# EAGLE design STKbd (EAGLE 8.0.1)
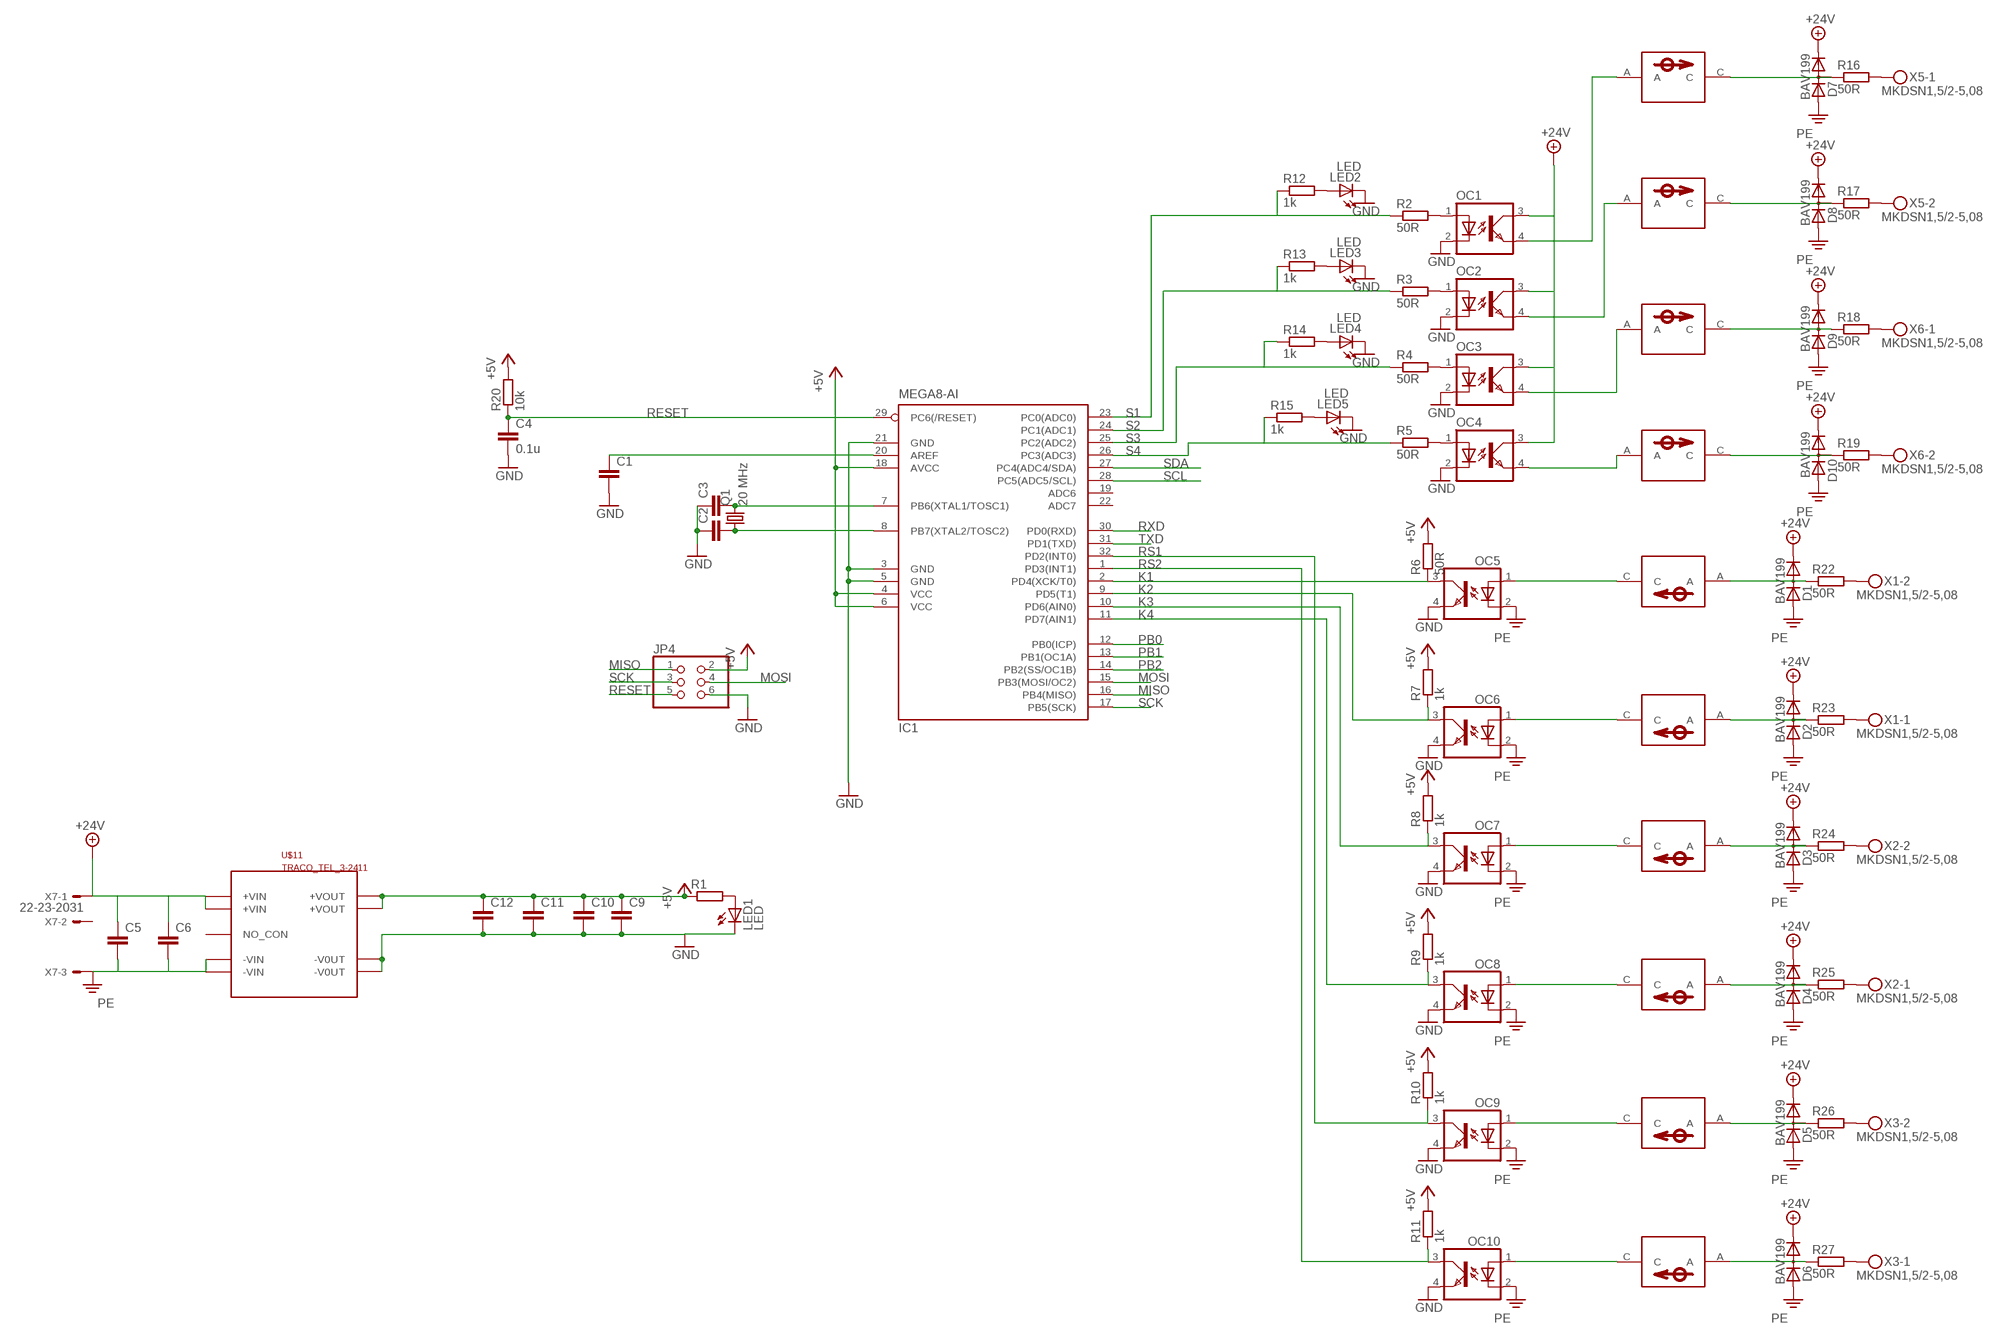
[diagram p0: schematic, sheet 1]

## Parts
C1  C-EUC0805K  [C0805K]
C2  C-EUC0805  [C0805]
C3  C-EUC0805  [C0805]
C4  0.1u  C-EUC0805K  [C0805K]
C5  C-EUC0805  [C0805]
C6  C-EUC0805  [C0805]
C9  C-EUC0805  [C0805]
C10  C-EUC0805  [C0805]
C11  C-EUC0805  [C0805]
C12  C-EUC0805  [C0805]
D1  BAV199  [SOT23]
D2  BAV199  [SOT23]
D3  BAV199  [SOT23]
D4  BAV199  [SOT23]
D5  BAV199  [SOT23]
D6  BAV199  [SOT23]
D7  BAV199  [SOT23]
D8  BAV199  [SOT23]
D9  BAV199  [SOT23]
D10  BAV199  [SOT23]
IC1  MEGA8-AI  [TQFP32-08]
JP4  PINHD-2X3  [2X03]
LED1  LED  [LED3MM]
LED2  LED  [LED3MM]
LED3  LED  [LED3MM]
LED4  LED  [LED3MM]
LED5  LED  [LED3MM]
OC1  SFH6106REAL  [SFH6106]
OC2  SFH6106REAL  [SFH6106]
OC3  SFH6106REAL  [SFH6106]
OC4  SFH6106REAL  [SFH6106]
OC5  SFH6106REAL  [SFH6106]
OC6  SFH6106REAL  [SFH6106]
OC7  SFH6106REAL  [SFH6106]
OC8  SFH6106REAL  [SFH6106]
OC9  SFH6106REAL  [SFH6106]
OC10  SFH6106REAL  [SFH6106]
Q1  20 MHz  CRYSTALSM49  [SM49]
R1  R-EU_R0805  [R0805]
R2  50R  R-EU_R0805  [R0805]
R3  50R  R-EU_R0805  [R0805]
R4  50R  R-EU_R0805  [R0805]
R5  50R  R-EU_R0805  [R0805]
R6  50R  R-EU_R0805  [R0805]
R7  1k  R-EU_R0805  [R0805]
R8  1k  R-EU_R0805  [R0805]
R9  1k  R-EU_R0805  [R0805]
R10  1k  R-EU_R0805  [R0805]
R11  1k  R-EU_R0805  [R0805]
R12  1k  R-EU_R0805  [R0805]
R13  1k  R-EU_R0805  [R0805]
R14  1k  R-EU_R0805  [R0805]
R15  1k  R-EU_R0805  [R0805]
R16  50R  R-EU_R0805  [R0805]
R17  50R  R-EU_R0805  [R0805]
R18  50R  R-EU_R0805  [R0805]
R19  50R  R-EU_R0805  [R0805]
R20  10k  R-EU_R0805  [R0805]
R22  50R  R-EU_R0805  [R0805]
R23  50R  R-EU_R0805  [R0805]
R24  50R  R-EU_R0805  [R0805]
R25  50R  R-EU_R0805  [R0805]
R26  50R  R-EU_R0805  [R0805]
R27  50R  R-EU_R0805  [R0805]
U$1  NSI45020AT1GSOD-123  [SOD123]
U$2  NSI45020AT1GSOD-123  [SOD123]
U$3  NSI45020AT1GSOD-123  [SOD123]
U$4  NSI45020AT1GSOD-123  [SOD123]
U$5  NSI45020AT1GSOD-123  [SOD123]
U$6  NSI45020AT1GSOD-123  [SOD123]
U$7  NSI45020AT1GSOD-123  [SOD123]
U$8  NSI45020AT1GSOD-123  [SOD123]
U$9  NSI45020AT1GSOD-123  [SOD123]
U$10  NSI45020AT1GSOD-123  [SOD123]
U$11  TRACO_TEL_3-2411  [TEL-3]
X1  MKDSN1,5/2-5,08  [MKDSN1,5/2-5,08]
X2  MKDSN1,5/2-5,08  [MKDSN1,5/2-5,08]
X3  MKDSN1,5/2-5,08  [MKDSN1,5/2-5,08]
X5  MKDSN1,5/2-5,08  [MKDSN1,5/2-5,08]
X6  MKDSN1,5/2-5,08  [MKDSN1,5/2-5,08]
X7  22-23-2031  [22-23-2031]

## Nets
+5V: C9.1 C10.1 C11.1 C12.1 IC1.4(VCC) IC1.6(VCC) IC1.18(AVCC) JP4.2 R1.1 R6.2 R7.2 R8.2 R9.2 R10.2 R11.2 R20.2 U$11.11(+VOUT) U$11.14(+VOUT)
+24V: C5.1 C6.1 D1.2(C) D2.2(C) D3.2(C) D4.2(C) D5.2(C) D6.2(C) D7.2(C) D8.2(C) D9.2(C) D10.2(C) OC1.3(COL) OC2.3(COL) OC3.3(COL) OC4.3(COL) U$11.1(+VIN) U$11.24(+VIN) X7.1
GND: C1.2 C2.1 C3.1 C4.2 C9.2 C10.2 C11.2 C12.2 IC1.3(GND) IC1.5(GND) IC1.21(GND) JP4.6 LED1.K(C) LED2.K(C) LED3.K(C) LED4.K(C) LED5.K(C) OC1.2(C) OC2.2(C) OC3.2(C) OC4.2(C) OC5.4(EMIT) OC6.4(EMIT) OC7.4(EMIT) OC8.4(EMIT) OC9.4(EMIT) OC10.4(EMIT) U$11.10(-V0UT) U$11.15(-V0UT)
K1: IC1.2(PD4(XCK/T0)) OC5.3(COL) R6.1
K2: IC1.9(PD5(T1)) OC6.3(COL) R7.1
K3: IC1.10(PD6(AIN0)) OC7.3(COL) R8.1
K4: IC1.11(PD7(AIN1)) OC8.3(COL) R9.1
MISO: IC1.16(PB4(MISO)) JP4.1
MOSI: IC1.15(PB3(MOSI/OC2)) JP4.4
N$1: OC1.1(A) R2.2
N$2: C1.1 IC1.20(AREF)
N$3: C3.2 IC1.7(PB6(XTAL1/TOSC1)) Q1.2
N$4: C2.2 IC1.8(PB7(XTAL2/TOSC2)) Q1.1
N$5: OC2.1(A) R3.2
N$6: OC3.1(A) R4.2
N$7: OC4.1(A) R5.2
N$8: R24.2 X2.2
N$9: D2.3(AC) R23.1 U$2.A
N$10: D7.3(AC) R16.1 U$7.C
N$11: D8.3(AC) R17.1 U$8.C
N$12: LED2.A R12.2
N$13: R16.2 X5.1
N$14: R17.2 X5.2
N$16: OC6.1(A) U$2.C
N$17: D9.3(AC) R18.1 U$9.C
N$18: R18.2 X6.1
N$19: D10.3(AC) R19.1 U$10.C
N$20: R19.2 X6.2
N$21: LED3.A R13.2
N$22: R22.2 X1.2
N$23: LED4.A R14.2
N$24: R26.2 X3.2
N$25: R23.2 X1.1
N$26: R25.2 X2.1
N$27: LED5.A R15.2
N$28: OC4.4(EMIT) U$10.A
N$29: OC3.4(EMIT) U$9.A
N$30: OC2.4(EMIT) U$8.A
N$31: OC8.1(A) U$4.C
N$32: OC9.1(A) U$5.C
N$33: OC10.1(A) U$6.C
N$34: OC1.4(EMIT) U$7.A
N$38: D3.3(AC) R24.1 U$3.A
N$39: D1.3(AC) R22.1 U$1.A
N$40: D4.3(AC) R25.1 U$4.A
N$41: D5.3(AC) R26.1 U$5.A
N$42: D6.3(AC) R27.1 U$6.A
N$43: R27.2 X3.1
N$44: LED1.A R1.2
N$46: OC7.1(A) U$3.C
N$47: OC5.1(A) U$1.C
PB0: IC1.12(PB0(ICP))
PB1: IC1.13(PB1(OC1A))
PB2: IC1.14(PB2(SS/OC1B))
PE: C5.2 C6.2 D1.1(A) D2.1(A) D3.1(A) D4.1(A) D5.1(A) D6.1(A) D7.1(A) D8.1(A) D9.1(A) D10.1(A) OC5.2(C) OC6.2(C) OC7.2(C) OC8.2(C) OC9.2(C) OC10.2(C) U$11.12(-VIN) U$11.13(-VIN) X7.3
RESET: C4.1 IC1.29(PC6(/RESET)) JP4.5 R20.1
RS1: IC1.32(PD2(INT0)) OC9.3(COL) R10.1
RS2: IC1.1(PD3(INT1)) OC10.3(COL) R11.1
RXD: IC1.30(PD0(RXD))
S1: IC1.23(PC0(ADC0)) R2.1 R12.1
S2: IC1.24(PC1(ADC1)) R3.1 R13.1
S3: IC1.25(PC2(ADC2)) R4.1 R14.1
S4: IC1.26(PC3(ADC3)) R5.1 R15.1
SCK: IC1.17(PB5(SCK)) JP4.3
SCL: IC1.28(PC5(ADC5/SCL))
SDA: IC1.27(PC4(ADC4/SDA))
TXD: IC1.31(PD1(TXD))
Unconnected: IC1.19(ADC6) IC1.22(ADC7) U$11.2(NO_CON) U$11.3(NO_CON) U$11.22(NO_CON) U$11.23(NO_CON) X7.2

## Library data of the parts
C1-C6 C9-C12 = rcl:C-EU: CAPACITOR, European symbol
D1-D10 = diode:BAV199: DIODE low-leakage double diode
IC1 = atmel:MEGA8: MICROCONTROLLER 8 Kbytes FLASH, 1 kbytes SRAM, 512 bytes EEPROM, USART, 6-channel 10 bit ADC, 2-channel 8 bit ADC Pin compatible with Atmega48, ATMega88, ATMega168 Source: avr.lbr; MPN: ATMEGA8-16AU; OC_FARNELL: 9171371; OC_NEWARK: 73M8863
JP4 = pinhead:PINHD-2X3: PIN HEADER
LED1-LED5 = MyLib:LED: TSAL4400 Hersteller Vishay Passender Empfänger: BPW85C TSAL4400 is a high efficiency infrared emitting diode in GaAlAs on GaAs technology, molded in clear, bluegrey tinted plastic packages. In comparison with the standard GaAs on GaAs technology these emitters achieve about 100 % radiant power improvement at a similar wavelength. The forward voltages at low current and at high pulse current roughly correspond to the low values of the standard technology. Therefore these emitters are ideally suitable as high performance replacements of standard emitters. Tipp: Gehause oft nicht angeschliffen: Anode = Langer Pin
OC1-OC10 = MyLib:SFH6106: SIEMENS OPTO COUPLER
Q1 = crystal:CRYSTAL: CRYSTAL; OC_FARNELL: unknown; OC_NEWARK: unknown
R1-R20 R22-R27 = rcl:R-EU_: RESISTOR, European symbol
U$1-U$10 = MyLib:NSI45020AT1G: Constant current source
U$11 = MyLib:TRACO_TEL_3-2411: The TEL 3 series is a range of isolated 3 Watt converters in DIL-24 package
X1-X3 X5 X6 = con-phoenix-508:MKDSN1,5/2-5,08: MKDSN 1,5/ 2-5,08 Printklemme Nennstrom: 13,5 A Nennspannung: 250 V Rastermaß: 5,08 mm Polzahl: 2 Anschlussart: Schraubanschluss Montage: Löten Anschlussrichtung Leiter/Platine: 0 ° Artikelnummer: 1729128 Source: http://eshop.phoenixcontact.com .. 1729128.pdf
X7 = con-molex:22-23-2031: .100" (2.54mm) Center Header - 3 Pin; MF: MOLEX; MPN: 22-23-2031; OC_FARNELL: 1462950; OC_NEWARK: 30C0862

## Net classes
0 default: clearance 0.205 mm

## Board
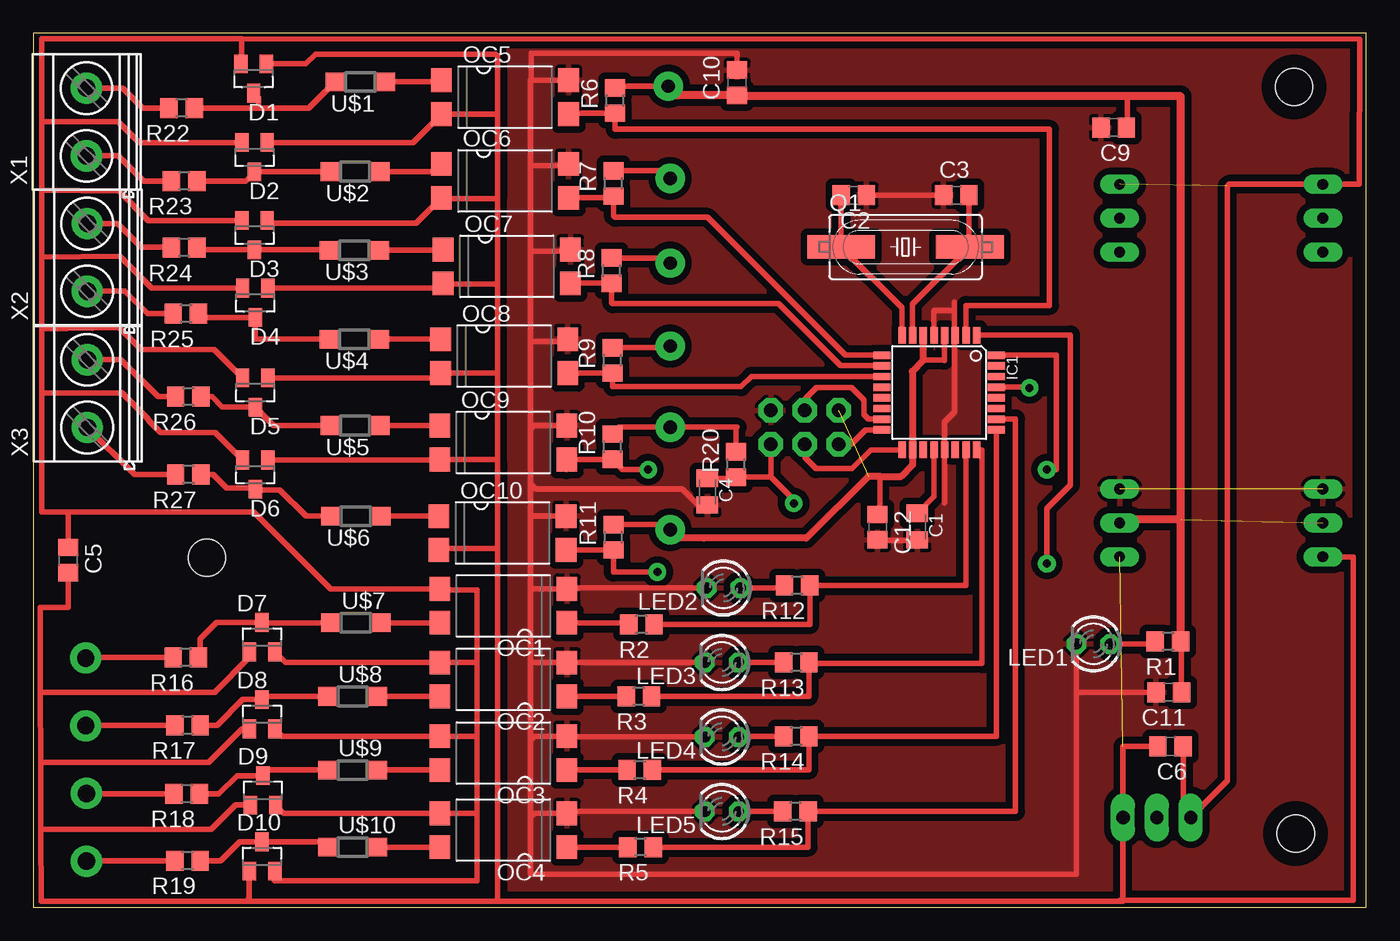
[diagram p1: board, top side]
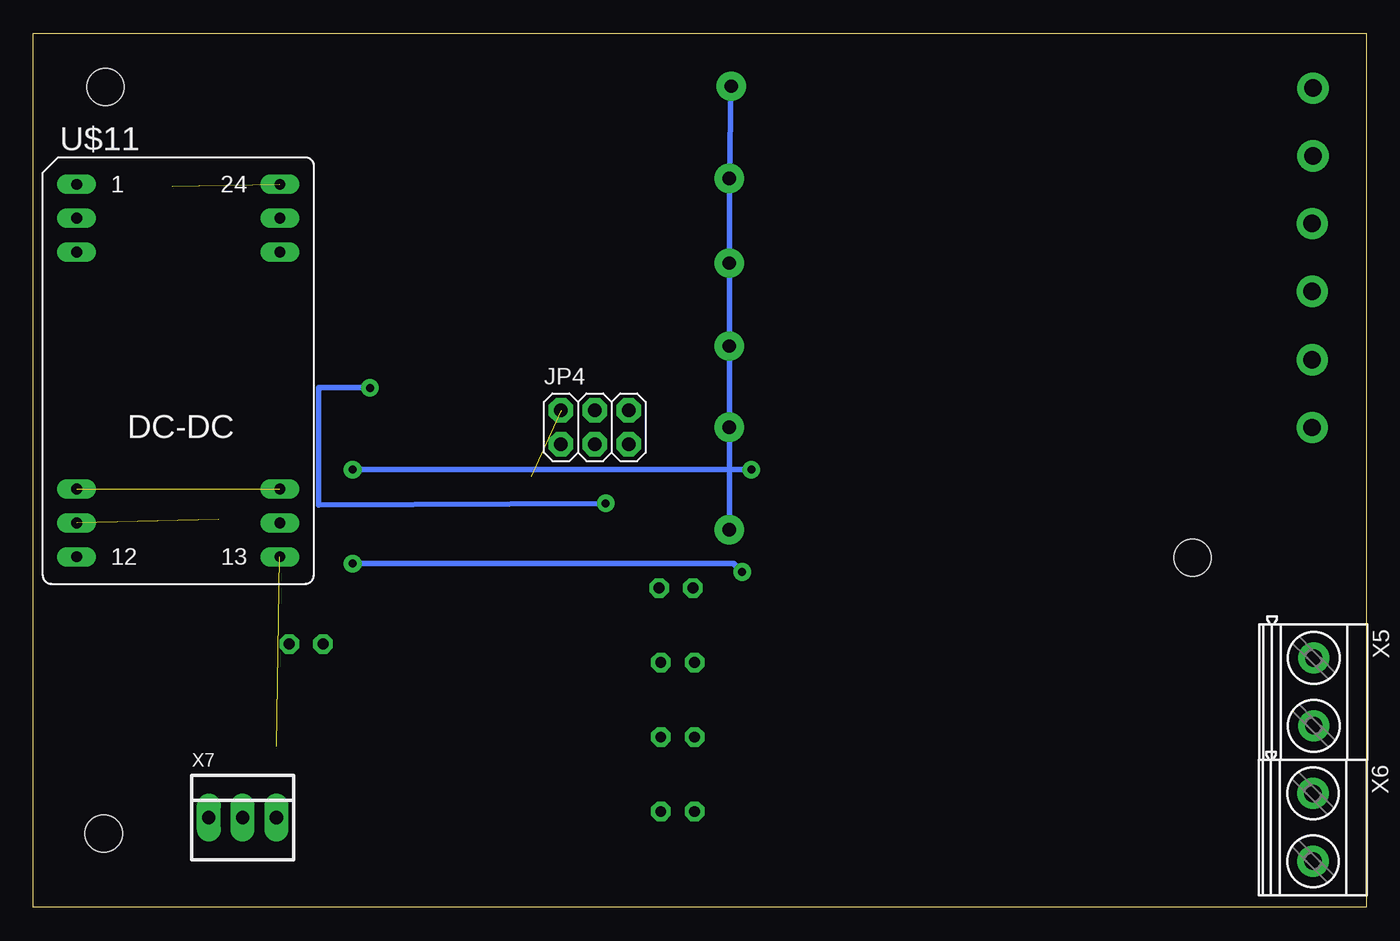
[diagram p2: board, bottom side, seen from below]

Size 99.97 x 65.58 mm. Coordinates in mm from the lower left corner, seen from the top.
Outline: 0,0 99.97,0 99.97,65.58 0,65.58 0,0
Copper layers (1*16): Top 0.035mm / dielectric 1.5mm / Bottom 0.035mm
Design rules "default *": minimum track width 10mil, minimum drill 24mil, track to track 20mil, track to pad 20mil, pad to pad 12mil, via to via 12mil, smd to smd 8mil, copper to edge 40mil, drill to drill 40mil, minimum pad ring 10mil, minimum via ring 8mil, stop-mask expansion 4mil, vias tented up to drill 0mil, thermal gap 10mil
Holes 2.8 mm at 13.03,26.25 94.56,61.56 94.69,5.55

### Footprints (pad centres in the part's own frame; a part is rotated, then mirrored left to right if it is on the bottom)
C0805K = smd 1.3 x 1.6: 1 -1,0; 2 1,0
C0805 = smd 1.3 x 1.5: 1 -0.95,0; 2 0.95,0
SOT23 = smd 1 x 1.4: 1 -0.95,-1.1; 2 0.95,-1.1; 3 0,1.1
TQFP32-08 = smd 1.27 x 0.559: 1 -4.293,2.8; 2 -4.293,2; 3 -4.293,1.2; 4 -4.293,0.4; 5 -4.293,-0.4; 6 -4.293,-1.2; 7 -4.293,-2; 8 -4.293,-2.8; 17 4.293,-2.8; 18 4.293,-2; 19 4.293,-1.2; 20 4.293,-0.4; 21 4.293,0.4; 22 4.293,1.2; 23 4.293,2; 24 4.293,2.8 | smd 0.559 x 1.27: 9 -2.8,-4.293; 10 -2,-4.293; 11 -1.2,-4.293; 12 -0.4,-4.293; 13 0.4,-4.293; 14 1.2,-4.293; 15 2,-4.293; 16 2.8,-4.293; 25 2.8,4.293; 26 2,4.293; 27 1.2,4.293; 28 0.4,4.293; 29 -0.4,4.293; 30 -1.2,4.293; 31 -2,4.293; 32 -2.8,4.293
2X03 = drill 1.016 octagon: 1 -2.54,-1.27; 2 -2.54,1.27; 3 0,-1.27; 4 0,1.27; 5 2.54,-1.27; 6 2.54,1.27
LED3MM = drill 0.813 octagon: A -1.27,0; K 1.27,0
SFH6106 = smd 1.78 x 1.55: 1 -1.27,-4.77; 2 1.27,-4.77; 3 1.27,4.77; 4 -1.27,4.77
SM49 = smd 5.08 x 1.778: 1 -4.826,0; 2 4.826,0
R0805 = smd 1.3 x 1.5: 1 -0.95,0; 2 0.95,0
SOD123 = smd 1.4 x 1.4: A 1.9,0; C -1.9,0
TEL-3 = drill 0.813 long: 1 -13.97,-7.62; 2 -11.43,-7.62; 3 -8.89,-7.62; 10 8.89,-7.62; 11 11.43,-7.62; 12 13.97,-7.62; 13 13.97,7.62; 14 11.43,7.62; 15 8.89,7.62; 22 -8.89,7.62; 23 -11.43,7.62; 24 -13.97,7.62
MKDSN1,5/2-5,08 = drill 1.3 pad 2: 1 -2.561,0.025; 2 2.519,0.025
22-23-2031 = drill 1 long: 1 -2.54,0; 2 0,0; 3 2.54,0

### Placement (x,y rotation side)
C1  66.31,28.57 270 top
C2  61.54,53.43 180 top
C3  69.23,53.43 0 top
C4  50.56,31.2 270 top
C5  2.62,26.06 270 top
C6  85.29,12.09 180 top
C9  81.04,58.51 180 top
C10  52.78,61.87 90 top
C11  85.17,16.15 180 top
C12  63.32,28.54 270 top
D1  16.52,62.19 180 top
D2  16.59,56.29 180 top
D3  16.59,50.44 180 top
D4  16.65,45.36 180 top
D5  16.65,38.63 180 top
D6  16.65,32.47 180 top
D7  17.16,20.28 0 top
D8  17.16,14.5 0 top
D9  17.22,8.79 0 top
D10  17.16,3.84 0 top
IC1  67.96,38.63 270 top
JP4  57.86,36.03 0 bottom
LED1  79.51,19.77 180 top
LED2  51.77,23.96 180 top
LED3  51.64,18.38 180 top
LED4  51.64,12.79 180 top
LED5  51.64,7.2 180 top
OC1  35.26,22.63 90 top
OC2  35.26,17.11 90 top
OC3  35.26,11.58 90 top
OC4  35.26,5.8 90 top
OC5  35.38,60.79 270 top
OC6  35.38,54.51 270 top
OC7  35.51,48.09 270 top
OC8  35.32,41.36 270 top
OC9  35.26,34.89 270 top
OC10  35.19,28.09 270 top
Q1  65.42,49.56 0 top
R1  85.1,19.96 180 top
R2  45.61,21.23 180 top
R3  45.42,15.84 180 top
R4  45.48,10.31 180 top
R5  45.54,4.53 180 top
R6  43.64,60.54 90 top
R7  43.51,54.32 90 top
R8  43.38,47.78 90 top
R9  43.45,41.05 90 top
R10  43.45,34.57 90 top
R11  43.51,27.77 90 top
R12  57.29,24.16 180 top
R13  57.23,18.38 180 top
R14  57.23,12.85 180 top
R15  57.16,7.2 180 top
R16  11.44,18.76 180 top
R17  11.57,13.68 180 top
R18  11.51,8.53 180 top
R19  11.57,3.52 180 top
R20  52.72,33.24 90 top
R22  11.13,59.97 180 top
R23  11.32,54.51 180 top
R24  11.32,49.49 180 top
R25  11.44,44.54 180 top
R26  11.63,38.32 180 top
R27  11.63,32.47 180 top
U$1  24.52,61.94 180 top
U$2  24.14,55.21 180 top
U$3  24.08,49.3 180 top
U$4  24.08,42.63 180 top
U$5  24.14,36.16 180 top
U$6  24.21,29.36 180 top
U$7  24.21,21.36 0 top
U$8  23.95,15.84 0 top
U$9  23.95,10.31 0 top
U$10  23.95,4.53 0 top
U$11  89.1,40.28 270 bottom
X1  4.01,58.95 90 top
X2  4.08,48.79 90 top
X3  4.08,38.57 90 top
X5  3.95,16.15 270 bottom
X6  4.01,5.99 270 bottom
X7  84.28,6.76 0 bottom

### Tracks (layer width: path | path; a pad name or v marks a point on that pad's centre or on a via)
+5V  (via drill 1)  (2 unrouted)
  Top 0.406: 47.7,48.41 v47.76,48.35 47.39,48.73 R8.2 | 47.7,54.64 v47.76,54.7 47.2,55.27 R7.2 | 82.18,28.92 82.18,29.04 81.48,29.04 U$11.14 81.48,29.11 | R1.1 86.12,19.96 C11.1 | C9.1 82.06,58.51 82.06,60.86 | v47.76,42.13 47.64,42 R9.2 | R10.2 43.96,36.03 v47.76,36.03 52.78,36.03 52.72,35.97 R20.2 | R6.2 43.77,61.62 v47.64,61.62 | C12.1 63.51,29.68 63.51,32.35 | IC1.4 68.34,42.91 68.34,41.05 68.33,41.05 66.76,41.05 | R11.2 47.39,28.73
  Top 0.508: IC1.6 66.76,41.05 65.93,40.22 65.93,34.37 IC1.18 65.96,33.2 65.1,32.35 63.51,32.35 62.62,32.35 57.99,27.71 50.31,27.71 48.4,27.71 v47.76,28.35 47.39,28.73
  Top 0.61: 86.06,29.11 86.06,60.86 82.06,60.86 52.85,60.86 C10.1 48.33,60.92 v47.64,61.62 | 86.06,29.11 81.48,29.11 | R1.1 86.06,29.11
  Bottom 0.406: v47.76,28.35 v47.76,36.03 v47.76,42.13 | v47.76,42.13 v47.76,48.35 v47.76,54.7 v47.64,61.62 | 47.76,41.05 v47.76,42.13
+24V  (1 unrouted)
  Top 0.406: D2.2 7.93,57.39 6.36,58.95 0.65,58.95 | D3.2 8.63,51.54 6.43,53.75 0.65,53.81 | D4.2 8.88,46.46 6.49,48.86 0.65,48.79 | 6.65,38.6 8.65,36.6 8.65,36.54 9.54,35.65 13.63,35.65 D6.2 | 6.65,38.6 6.62,38.63 | D5.2 13.56,41.87 8.08,41.87 6.43,43.52 0.65,43.4 | 33.29,12.79 33.29,18.5 | 33.29,6.95 33.29,12.79 | 33.29,18.5 33.29,23.84 30.55,23.84 OC1.3 | 30.49,23.84 OC1.3 | 18.13,19.2 D7.2 18.91,18.38 OC2.3 33.16,18.38 33.29,18.5 | 18.13,13.42 D8.2 18.66,12.85 OC3.3 33.22,12.85 33.29,12.79 | 18.21,7.65 D9.2 18.79,7.07 OC4.3 | 30.36,6.95 OC4.3 | OC4.3 33.16,7.07 33.29,6.95 | 0.65,58.95 0.65,65.18 15.63,65.17 | 0.65,53.81 0.65,58.95 | 0.65,48.79 0.65,53.81 | 0.65,43.4 0.65,48.79 | 0.65,38.6 0.65,43.4 | 6.65,38.6 0.65,38.6 | 96.72,54.19 U$11.1 | 15.63,65.17 99.49,65.14 99.45,54.25 U$11.1 | U$11.1 96.6,54.38 | 2.62,29.68 16.52,29.68 22.3,23.9 OC1.3 | 2.62,29.68 0.65,29.68 0.65,38.6 | U$11.1 89.68,54.25 89.55,54.13 89.55,9.49 X7.1 86.24,7.33 C6.1 | D1.2 15.63,63.29 15.63,65.17 | C5.1 2.62,29.68 | D10.2 18.11,1.99 33.29,1.99 33.29,6.95
  Bottom 0.406: X7.1 86.82,6.12
GND  (1 unrouted)
  Top 0.406: C3.1 C2.1 | 37.29,23.9 OC1.2 40.03,23.97 LED2.K | 37.29,12.54 37.29,18.25 | 37.29,6.82 37.29,12.54 | 37.29,18.25 37.29,23.9 | 37.29,29.36 OC10.4 | 37.29,29.36 37.29,23.9 | OC2.2 37.41,18.38 37.29,18.25 | 37.29,12.54 37.6,12.85 OC3.2 40.03,12.79 LED4.K | 37.29,6.82 37.54,7.07 OC4.2 40.03,7.2 LED5.K | 40.09,18.44 OC2.2 | LED3.K OC2.2 | 37.29,6.82 37.29,2.5 78.25,2.5 78.25,16.15 | 81.48,31.59 U$11.15 | 69.1,44.79 69.1,42.93 IC1.3 69.1,42.87 69.1,37.17 68.36,36.43 IC1.21 68.36,30.33 | 69.1,44.79 69.1,45.43 | 37.35,62.06 OC5.4 | 37.29,55.65 37.29,62.06 37.35,62.06 | 37.29,49.24 37.29,55.65 | 37.29,42.44 37.29,49.24 | 37.29,35.9 37.29,42.44 | 37.29,31.78 37.29,35.9 | 37.29,31.78 37.29,29.36 | OC6.4 40.03,55.65 37.29,55.65 | OC7.4 40.15,49.24 37.29,49.24 | OC8.4 39.9,42.44 37.29,42.44 | OC9.4 37.54,36.16 37.29,35.9 | C10.2 52.78,64.1 37.35,64.1 37.35,62.06 | 78.25,16.15 LED1.K | C11.2 78.25,16.15 | 37.29,31.78 37.67,31.39 48.65,31.39 49.78,30.27 | 65.54,27.52 64.23,27.52 | IC1.5 67.56,44.79 69.1,44.79
  pour Top: 0,65.58 99.97,65.58 99.97,0 0,0
K1
  Top 0.406: 69.99,42.96 IC1.2 69.96,45.17 76.21,45.17 76.21,58.38 43.64,58.38 R6.1 40.15,59.59 OC5.3
K2
  Top 0.406: OC6.3 43.51,53.24 R7.1 43.51,51.9 43.64,51.78 50.56,51.78 60.9,41.43 IC1.9
  Top 0.508: 63.44,41.43 IC1.9
K3
  Top 0.406: IC1.10 63.63,40.67 60.53,40.67 55.89,45.3 43.45,45.3 43.38,45.36 R8.1 OC7.3
K4
  Top 0.406: IC1.11 53.86,39.84 53.1,39.08 43.45,39.08 R9.1 OC8.3
MISO
  Top 0.406: IC1.16 62.43,35.83 61.35,34.76 JP4.1
MOSI
  Top 0.406: IC1.15 62.66,36.63 62.31,36.98 62.31,38.06 61.35,39.01 58.75,39.01 57.93,38.19 57.93,37.36 JP4.4
N$1
  Top 0.406: OC1.1 44.66,21.36 R2.2
N$2
  Top 0.406: C1.1 67.56,30.82 IC1.20
N$3
  Top 0.406: IC1.7 65.96,45.27 Q1.2 70.18,49.56 C3.2
N$4
  Top 0.406: Q1.1 | IC1.8 65.16,44.99 Q1.1 | C2.2 Q1.1
  Top 0.508: IC1.8
N$5
  Top 0.406: R3.2 OC2.1
N$6
  Top 0.406: R4.2 OC3.1
N$7
  Top 0.406: OC4.1 R5.2
N$8
  Top 0.406: X2.2 6.32,51.31 8.08,49.56 10.3,49.56 R24.2
N$9
  Top 0.406: U$2.A 22.22,55.19 D2.3 15.91,54.51 R23.1
N$10
  Top 0.406: U$7.C 17.18,21.36 D7.3 13.75,21.38 12.52,20.16 12.52,18.89 R16.1
N$11
  Top 0.406: D8.3 17.26,15.71 | D8.3 15.72,15.6 13.79,13.68 R17.1 | U$8.C 17.39,15.84 D8.3
N$12
  Top 0.406: LED2.A 56.34,23.97 R12.2
N$13
  Top 0.406: R16.2 3.97,18.76 X5.1
N$14
  Top 0.406: R17.2 3.97,13.68 X5.2
N$16
  Top 0.406: U$2.C 30.04,55.21 OC6.1
N$17
  Top 0.406: D9.3 17.24,9.87 | D9.3 15.27,9.89 13.92,8.53 R18.1 | U$9.C 17.65,10.31 D9.3
N$18
  Top 0.406: R18.2 4.01,8.53 X6.1
N$19
  Top 0.406: 17.18,4.91 D10.3 | D10.3 15.46,4.94 14.05,3.52 R19.1 | D10.3 21.65,4.94 U$10.C
N$20
  Top 0.406: R19.2 4.03,3.52 X6.2
N$21
  Top 0.406: R13.2 LED3.A
N$22
  Top 0.406: X1.2 6.7,61.47 8.2,59.97 R22.2
N$23
  Top 0.406: R14.2 52.91,12.85 LED4.A
N$24
  Top 0.406: X3.2 4.07,41.11 6.55,41.11 9.35,38.32 R26.2
N$25
  Top 0.406: X1.1 6.38,56.39 8.27,54.51 R23.2
N$26
  Top 0.406: R25.2 8.59,44.54 6.87,46.25 4.07,46.25 X2.1
N$27
  Top 0.406: R15.2 LED5.A
N$28
  Top 0.406: OC4.4 U$10.A
N$29
  Top 0.406: OC3.4 U$9.A
N$30
  Top 0.406: OC2.4 U$8.A
N$31
  Top 0.406: OC8.1 U$4.C
N$32
  Top 0.406: OC9.1 U$5.C
N$33
  Top 0.406: OC10.1 U$6.C
N$34
  Top 0.406: U$7.A OC1.4
N$38
  Top 0.406: R24.1 12.41,49.34 16.08,49.34 | 16.08,49.34 D3.3 | U$3.A 22.14,49.34 16.08,49.34
N$39
  Top 0.406: U$1.A 20.66,59.97 16.9,59.97 | D1.3 16.9,60.71 16.9,59.97 | 16.9,59.97 R22.1
N$40
  Top 0.406: R25.1 12.67,44.26 D4.3 16.65,42.63 U$4.A
N$41
  Top 0.406: R26.1 13.41,38.32 14.17,37.55 16.63,37.55 D5.3 18.03,36.16 U$5.A
N$42
  Top 0.406: R27.1 13.47,32.47 14.49,31.46 16.57,31.46 D6.3 | 16.88,31.14 D6.3 | U$6.A 20.46,29.36 18.49,31.33 16.69,31.33 D6.3
N$43
  Top 0.406: X3.1 7.59,32.47 R27.2
N$44
  Top 0.406: LED1.A 84.15,19.77 R1.2
N$46
  Top 0.406: OC7.1 30.68,49.3 U$3.C
N$47
  Top 0.406: U$1.C 30.61,61.94 OC5.1
PE  (1 unrouted)
  Top 0.406: 17.6,33.62 D6.1 30.96,33.57 31,33.62 | 17.6,39.71 D5.1 30.19,39.73 OC8.2 34.81,40.09 | 34.81,26.95 34.81,0.47 | D7.1 16.21,18.76 13.6,16.15 0.52,16.15 | 0.54,10.88 0.52,16.15 | 0.56,5.8 0.54,10.88 | 0.56,5.8 0.58,0.47 15.95,0.47 | 15.95,0.47 34.81,0.47 | D8.1 15.68,13.4 13.16,10.88 0.54,10.88 | D9.1 15.17,7.69 13.35,5.87 0.63,5.87 0.56,5.8 | D10.1 16.21,0.73 15.95,0.47 | 34.81,26.95 30.55,26.95 OC10.2 | X7.3 81.67,6.76 | 34.81,40.09 34.81,46.76 | 34.81,33.49 34.81,40.09 | 34.81,33.49 34.81,26.95 | 34.81,46.76 34.81,53.18 | 34.81,59.52 34.81,53.18 | 17.54,63.29 D1.1 20.42,63.29 21.16,64.03 34.68,64.03 34.81,63.91 34.81,59.52 | 81.48,0.47 34.81,0.47 | 81.48,0.47 81.74,0.47 X7.3 | U$11.12 99.01,26.31 99.01,0.53 81.48,0.53 81.48,0.47 | 34.81,59.52 OC5.2 28.47,57.39 D2.1 | 34.81,53.18 30.68,53.18 OC6.2 28.71,51.33 17.75,51.33 D3.1 | 34.81,46.76 30.8,46.76 OC7.2 30.38,46.46 D4.1 | 31,33.62 OC9.2 | 31,33.62 34.68,33.62 34.81,33.49 | C6.2 81.74,12.09 X7.3 | C5.2 2.62,22.5 0.52,22.5 0.52,16.15
RESET  (via drill 0.6)
  Top 0.305: v57.04,30.31 57.04,30.57
  Top 0.406: IC1.29 74.72,39.03 v74.72,38.98 | 55.32,32.28 57.04,30.57 | JP4.5 55.32,32.28 | C4.1 52.64,32.2 R20.1 55.32,32.29 55.32,32.28
  Bottom 0.406: v74.72,38.98 74.72,39.01 78.56,39.01 78.56,30.19 v57.04,30.31
RS1  (via drill 0.6)
  Top 0.406: 39.96,32.86 OC9.3 R10.1 44.21,32.86 v46.11,32.86 | IC1.32 76.72,41.43 76.72,32.86 v76.02,32.86
  Bottom 0.406: 46.11,32.79 v46.11,32.86 v76.02,32.86
RS2  (via drill 0.6)
  Top 0.406: OC10.3 R11.1 43.51,25.17 v46.81,25.17 | 70.76,42.89 IC1.1 70.76,42.95 77.8,42.95 77.8,31.71 76.02,29.93 v76.02,25.81
  Bottom 0.406: 75.96,25.74 v76.02,25.81 47.45,25.81 v46.81,25.17
S1
  Top 0.406: 46.56,21.17 R2.1 58.24,21.23 R12.1 69.96,24.16 IC1.23
S2
  Top 0.406: R3.1 58.18,15.84 R13.1 58.18,18.31 71.13,18.31 71.13,34.34 IC1.24
S3
  Top 0.406: R4.1 58.18,10.31 R14.1 72.25,12.85 IC1.25
S4
  Top 0.406: R5.1 58.11,4.53 R15.1 73.67,7.2 73.67,36.66 72.25,36.66 IC1.26
SCK
  Top 0.305: 65.07,34.25 IC1.17
  Top 0.406: IC1.17 62.84,34.34 61.42,32.92 58.69,32.92 57.86,33.74 JP4.3